# Altium schematic sheet LPCB235 - HE ISO CHANNEL.SchDoc
size A3; Address1: Factory 10; Address2: 9-13 Dingley Avenue, Dandeong, VICTORIA 3175, AUSTRALIA; DocumentNumber: 13; Revision: 1; SheetNumber: 13; SheetTotal: 37; Lockie__PCB_SUB_ASSEMBLY: HE Isolated Channels; Lockie__PCB_ASSEMBLY: FCU PCB; Lockie__LDL: LPCB235; Lockie__PCB_DESCRIPTION: Flight Control Unit
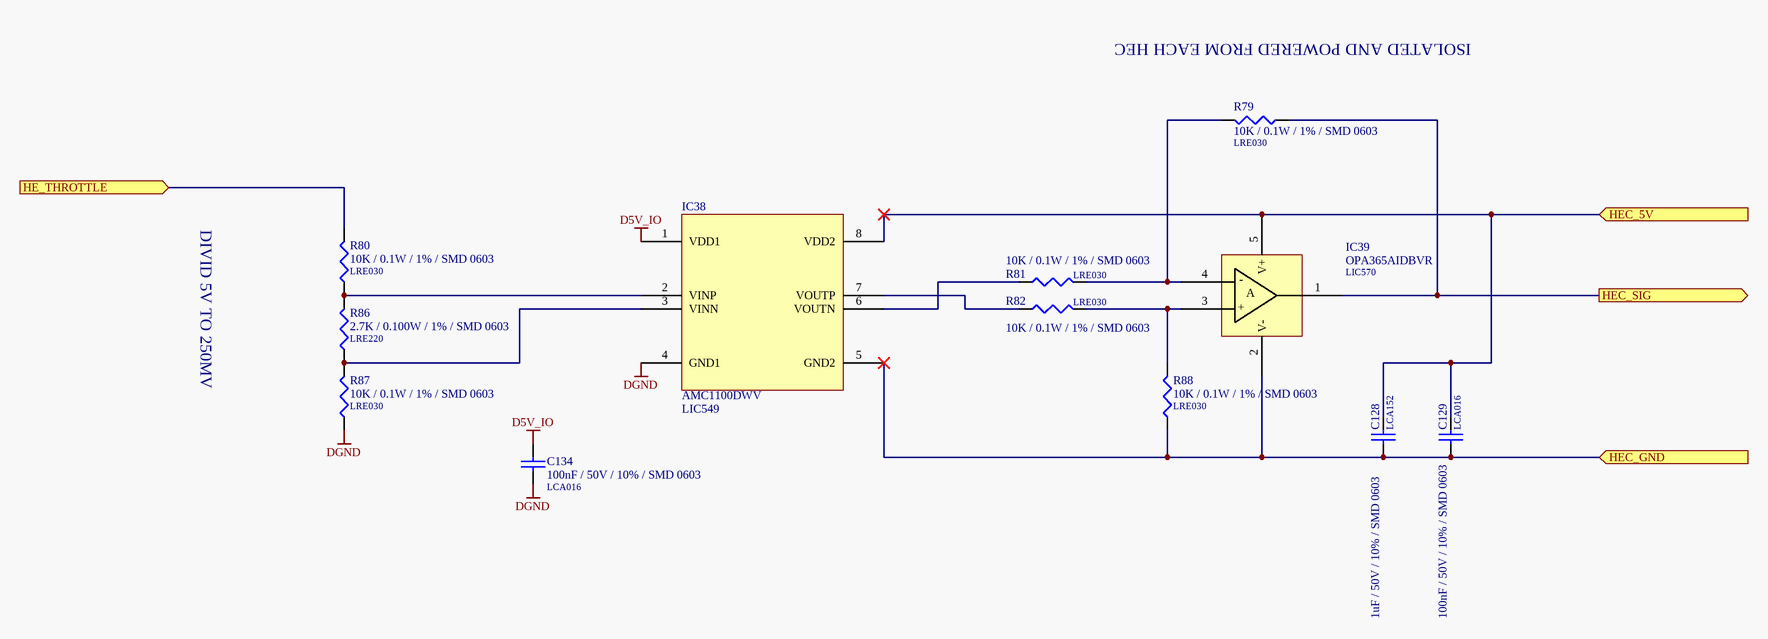
[diagram p0: LPCB235 - HE ISO CHANNEL.SchDoc]

## Parts
C128  1uF / 50V / 10% / SMD 0603  LDL_NUMBER: LCA152  [LFP011__CC1608-0603-IPC7351_B]
C129  100nF / 50V / 10% / SMD 0603  LDL_NUMBER: LCA016  [LFP011__CC1608-0603-IPC7351_B]
C134  100nF / 50V / 10% / SMD 0603  LDL_NUMBER: LCA016  [LFP011__CC1608-0603-IPC7351_B]
IC38  AMC1100DWV  LDL_NUMBER: LIC549  [LFP150__DWV0008A]
IC39  OPA365AIDBVR  LDL_NUMBER: LIC570  [LFP114__R-PDSO-G5]
R79  10K / 0.1W / 1% / SMD 0603  LDL_NUMBER: LRE030  [LFP020__CR1608-0603-IPC7351_B]
R80  10K / 0.1W / 1% / SMD 0603  LDL_NUMBER: LRE030  [LFP020__CR1608-0603-IPC7351_B]
R81  10K / 0.1W / 1% / SMD 0603  LDL_NUMBER: LRE030  [LFP020__CR1608-0603-IPC7351_B]
R82  10K / 0.1W / 1% / SMD 0603  LDL_NUMBER: LRE030  [LFP020__CR1608-0603-IPC7351_B]
R86  2.7K / 0.100W / 1% / SMD 0603  LDL_NUMBER: LRE220  [LFP020__CR1608-0603-IPC7351_B]
R87  10K / 0.1W / 1% / SMD 0603  LDL_NUMBER: LRE030  [LFP020__CR1608-0603-IPC7351_B]
R88  10K / 0.1W / 1% / SMD 0603  LDL_NUMBER: LRE030  [LFP020__CR1608-0603-IPC7351_B]

## Ports
HE_THROTTLE (in), HEC_5V (in), HEC_GND (in), HEC_SIG (out)

## Nets
D5V_IO: C134.1 IC38.1(VDD1)
DGND: C134.2 IC38.4(GND1) R87.1
HE_THROTTLE: R80.2 ; port HE_THROTTLE
HEC_5V: C128.1 C129.1 IC38.8(VDD2) IC39.5(V+) ; port HEC_5V
HEC_GND: C128.2 C129.2 IC38.5(GND2) IC39.2(V-) R88.1 ; port HEC_GND
HEC_SIG: IC39.1(OUT_A) R79.1 ; port HEC_SIG
NetIC38_2: IC38.2(VINP) R80.1 R86.2
NetIC38_3: IC38.3(VINN) R86.1 R87.2
NetIC38_6: IC38.6(VOUTN) R81.1
NetIC38_7: IC38.7(VOUTP) R82.1
NetIC39_3: IC39.3(+IN_A) R82.2 R88.2
NetIC39_4: IC39.4(-IN_A) R79.2 R81.2

## Notes on the sheet
- ISOLATED AND POWERED FROM EACH HEC
- DIVID 5V TO 250MV
- PCB COMPONENT DESCRIPTION
- LDL NUMBER
- Assembly Details
- Size
- Drawing File Name
- Revision
- http://rloop.org
- Scale
- A3
- Sheet Details
- N.T.S
- Sheet:
- Of:
- (in symbol OPA365AIDBVR) -; A; +

## Library data of the parts
C128 = 1uF / 50V / 10% / SMD 0603: Capacitor, Ceramic Chip, 1uF, 50V, 10% (X5R), SMD 0603 [LCA152]; Value: 1u; FMEDA__OPERATING__VOLTAGE_MAX: 50; FMEDA__OPERATING__VOLTAGE_MIN: 0; FMEDA__OPERATING__TEMP_MAX: 85; FMEDA__OPERATING__TEMP_MIN: -55; FMEDA__OPERATING__TEMP_TYP: 27; FMEDA__CHANNEL: COM; FMEDA__OPERATING__VOLTAGE_TYP: 0; FMEDA__FUNCTION_IN_SYSTEM: *
C129 C134 = 100nF / 50V / 10% / SMD 0603: Capacitor, Ceramic Chip, 100nF (0.1uF), 50V, 5%, SMD 0603 [LCA016]; Value: 100n; FMEDA__OPERATING__VOLTAGE_MIN: 0; FMEDA__OPERATING__VOLTAGE_MAX: 3.3; FMEDA__OPERATING__TEMP_MIN: -20; FMEDA__OPERATING__TEMP_TYP: 27; FMEDA__OPERATING__TEMP_MAX: 50; FMEDA__CHANNEL: COM; FMEDA__FUNCTION_IN_SYSTEM: *; FMEDA__OPERATING__VOLTAGE_TYP: 3.3
IC38 = AMC1100DWV: IC, Isolation Amplifier, SMD SOIC8 [LIC549]
IC39 = OPA365AIDBVR: IC, OpAmp, 1-Channel, Low Noise, SMD SOT-23-5 [LIC570]; FMEDA__OPERATING__TEMP_MAX: 125; FMEDA__OPERATING__TEMP_MIN: -40; FMEDA__OPERATING__TEMP_TYP: 27; FMEDA__CHANNEL: COM; FMEDA__FUNCTION_IN_SYSTEM: *
R79-R82 R87 R88 = 10K / 0.1W / 1% / SMD 0603: Resistor, Ceramic Chip, 10K, 0.1W, 1%, SMD 0603 [LRE030]; FMEDA__OPERATING__POWER_MAX: 0; FMEDA__OPERATING__TEMP_MAX: 50; FMEDA__OPERATING__TEMP_MIN: -20; FMEDA__OPERATING__TEMP_TYP: 27; FMEDA__CHANNEL: COM; Value: 10K; FMEDA__OPERATING__POWER_MIN: 0; FMEDA__OPERATING__VOLTAGE_MAX: 0; FMEDA__OPERATING__VOLTAGE_MIN: 0; FMEDA__OPERATING__VOLTAGE_TYP: 0; FMEDA__FUNCTION_IN_SYSTEM: *
R86 = 2.7K / 0.100W / 1% / SMD 0603: Resistor, Thick Film, 2.7K, 0.100W, 75V, 1%, SMD 0603 [LRE220]; FMEDA__OPERATING__POWER_MAX: 0.1; FMEDA__OPERATING__POWER_MIN: 0; FMEDA__OPERATING__VOLTAGE_MAX: 75; FMEDA__OPERATING__TEMP_MAX: 155; FMEDA__OPERATING__TEMP_MIN: -55; FMEDA__OPERATING__TEMP_TYP: 27; FMEDA__CHANNEL: COM; VALUE: 2.7K; FMEDA__OPERATING__VOLTAGE_MIN: 0; FMEDA__OPERATING__VOLTAGE_TYP: 75; FMEDA__FUNCTION_IN_SYSTEM: *